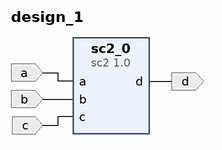
[diagram p0: block diagram of the top level]
# Vivado block design design_1, xc7a100tcsg324-1, Vivado 2023.2
create_bd_design design_1

create_bd_port -dir I -type data c
create_bd_port -dir I -type data b
create_bd_port -dir I -type data a
create_bd_port -dir O -type data d

create_bd_cell -type ip -vlnv xilinx.com:hls:sc2:1.0 sc2_0

# ---- connections ----

connect_bd_net -net a_0_1 [get_bd_ports a] [get_bd_pins sc2_0/a]
connect_bd_net -net b_0_1 [get_bd_ports b] [get_bd_pins sc2_0/b]
connect_bd_net -net c_0_1 [get_bd_ports c] [get_bd_pins sc2_0/c]
connect_bd_net [get_bd_pins sc2_0/d] [get_bd_ports d]

validate_bd_design
save_bd_design
